# EAGLE design Stenophone-Breakout (EAGLE 7.4.0)
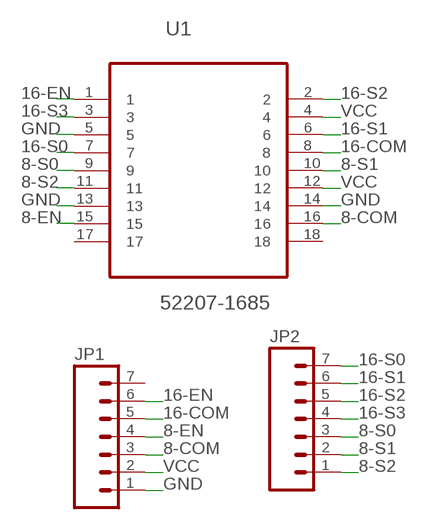
[diagram p0: schematic, sheet 1]

## Parts
JP1  M07  [1X07]
JP2  M07  [1X07]
U1  52207-1685  [MOLEX_52207-1685]

## Nets
8-COM: JP1.3 U1.16
8-EN: JP1.4 U1.15
8-S0: JP2.3 U1.9
8-S1: JP2.2 U1.10
8-S2: JP2.1 U1.11
16-COM: JP1.5 U1.8
16-EN: JP1.6 U1.1
16-S0: JP2.7 U1.7
16-S1: JP2.6 U1.6
16-S2: JP2.5 U1.2
16-S3: JP2.4 U1.3
GND: JP1.1 U1.5 U1.13 U1.14
VCC: JP1.2 U1.4 U1.12
Unconnected: JP1.7 U1.17 U1.18

## Library data of the parts
JP1 JP2 = SparkFun-Connectors:M07: Header 7 Standard 7-pin 0.1" header. Use with straight break away headers (SKU : PRT-00116), right angle break away headers (PRT-00553), swiss pins (PRT-00743), machine pins (PRT-00117), and female headers (PRT-00115). NOTES ON THE VARIANTS LOCK and LOCK_LONGPADS... This footprint was designed to help hold the alignment of a through-hole component (i.e. 7-pin header) while soldering it into place. You may notice that each hole has been shifted either up or down by 0.005 of an inch from it's more standard position (which is usually a perfectly straight line). This slight alteration caused the pins (the squares in the middle) to touch the edges of the holes. Because they are alternating, it causes a "brace" to hold the header in place. 0.005 has proven to be the perfect amount of "off-center" position when using our standard breakaway headers. Although looks a little odd when you look at the bare footprint, once you have a header in there, the alteration is very hard to notice. Also, if you push a header all the way into place, it is covered up entirely on the bottom side. This idea of altering the position of holes to aid alignment will be further integrated into the Sparkfun Library for other footprints. It can help hold any component with 3 or more connection pins.
U1 = Molex_By_element14_Batch_1:52207-1685: SOCKET FPC, SMT, 1MM, 16WAY; MPN: 52207-1685; OC_FARNELL: 1079941; OC_NEWARK: 66K6176; PACKAGE: SOCKET FPC, SMT, 1MM, 16WAY; SUPPLIER: Molex

## Board
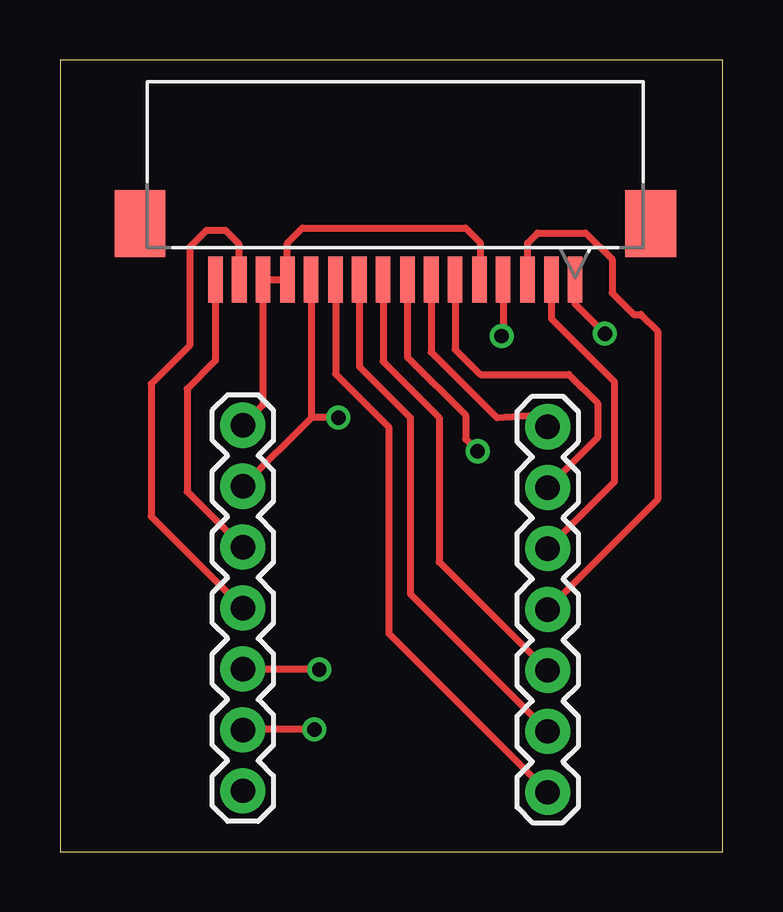
[diagram p1: board, top side]
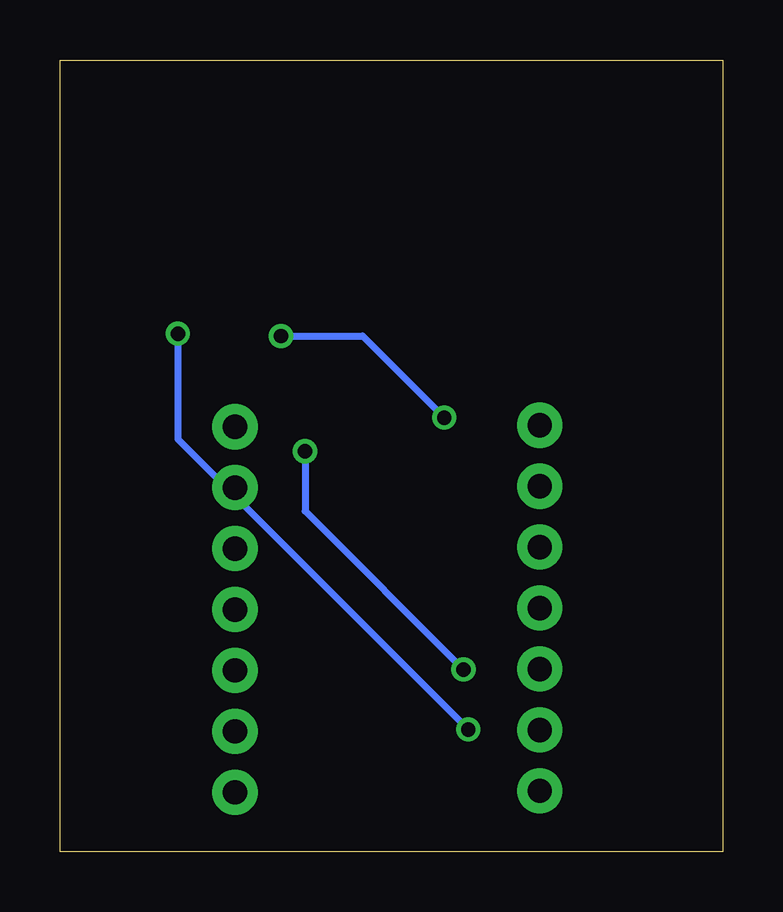
[diagram p2: board, bottom side, seen from below]

Size 27.61 x 33.01 mm. Coordinates in mm from the lower left corner, seen from the top.
Outline: 0,0 27.61,0 27.61,33.01 0,33.01 0,0
Copper layers (1*16): Top 0.035mm / dielectric 1.5mm / Bottom 0.035mm
Design rules "default": minimum track width 10mil, minimum drill 24mil, track to track 8mil, track to pad 8mil, pad to pad 8mil, via to via 8mil, smd to smd 8mil, copper to edge 40mil, drill to drill 8mil, minimum pad ring 10mil, minimum via ring 8mil, stop-mask expansion 4mil, vias tented up to drill 0mil, thermal gap 10mil

### Footprints (pad centres in the part's own frame; a part is rotated, then mirrored left to right if it is on the bottom)
1X07 = drill 1.016 pad 1.88: 1 0,0; 2 2.54,0; 3 5.08,0; 4 7.62,0; 5 10.16,0; 6 12.7,0; 7 15.24,0
MOLEX_52207-1685 = smd 0.61 x 1.905: 1 7.493,4.801; 2 6.502,4.801; 3 5.512,4.801; 4 4.496,4.801; 5 3.505,4.801; 6 2.489,4.801; 7 1.499,4.801; 8 0.508,4.801; 9 -0.508,4.801; 10 -1.499,4.801; 11 -2.489,4.801; 12 -3.505,4.801; 13 -4.496,4.801; 14 -5.512,4.801; 15 -6.502,4.801; 16 -7.493,4.801 | smd 2.108 x 2.794: 17 -10.643,7.137; 18 10.643,7.137

### Placement (x,y rotation side)
JP1  7.62,17.78 270 top
JP2  20.32,2.48 90 top
U1  13.97,19.05 0 top

### Tracks (layer width: path | path; a pad name or v marks a point on that pad's centre or on a via)
8-COM
  Top 0.3: U1.16 6.48,20.48 5.3,19.3 5.3,15.02 JP1.3
8-EN
  Top 0.3: U1.15 7.47,25.33 6.9,25.9 6.1,25.9 5.4,25.2 5.4,21.1 3.8,19.5 3.8,13.98 JP1.4
8-S0
  Top 0.3: U1.9 13.46,20.44 15.8,18.1 15.8,12.08 JP2.3
8-S1
  Top 0.3: U1.10 12.47,20.23 14.6,18.1 14.6,10.74 JP2.2
8-S2
  Top 0.3: U1.11 11.48,19.92 13.7,17.7 13.7,9.1 JP2.1
16-COM  (via drill 0.6)
  Top 0.3: U1.8 14.48,20.62 16.9,18.2 16.9,17.2 v17.4,16.7 | v10.8,7.6 7.64,7.6 JP1.5
  Bottom 0.3: v17.4,16.7 17.4,14.2 v10.8,7.6
16-EN  (via drill 0.6)
  Top 0.3: U1.1 21.46,22.84 v22.7,21.6 | v10.6,5.1 7.64,5.1 JP1.6
  Bottom 0.3: v22.7,21.6 22.7,17.2 v10.6,5.1
16-S0
  Top 0.3: U1.7 15.47,20.83 18.2,18.1 19.84,18.2 JP2.7
16-S1
  Top 0.3: U1.6 16.46,20.94 17.5,19.9 21.2,19.9 22.4,18.7 22.4,17.26 JP2.6
16-S2
  Top 0.3: U1.2 20.47,22.23 23.1,19.6 23.1,15.42 JP2.5
16-S3
  Top 0.3: U1.3 19.48,25.38 19.9,25.8 21.9,25.8 23,24.7 23,23.3 23.9,22.4 24.2,22.4 24.9,21.7 24.9,14.68 JP2.4
GND
  Top 0.3: JP1.1 8.46,18.62 U1.14 U1.13 9.47,25.37 10.1,26 16.9,26 17.5,25.4 17.5,23.88 U1.5
VCC  (via drill 0.6 pad 0.4)
  Top 0.3: U1.12 10.46,18.09 | 10.46,18.09 JP1.2 | U1.4 18.47,21.57 v18.4,21.5 | v11.6,18.1 10.48,18.1 10.46,18.09
  Bottom 0.3: v18.4,21.5 15,21.5 v11.6,18.1